# EAGLE design pm25 (EAGLE 9.5.1)
AUTHOR: Jared Wolff; BOARD_NUMBER: BRD-0010; COMPANY: Circuit Dojo; DOC_NUMBER: SCH-0010; DOC_REV: 5; TITLE: Air Quality Wing
Assembly variants: Production
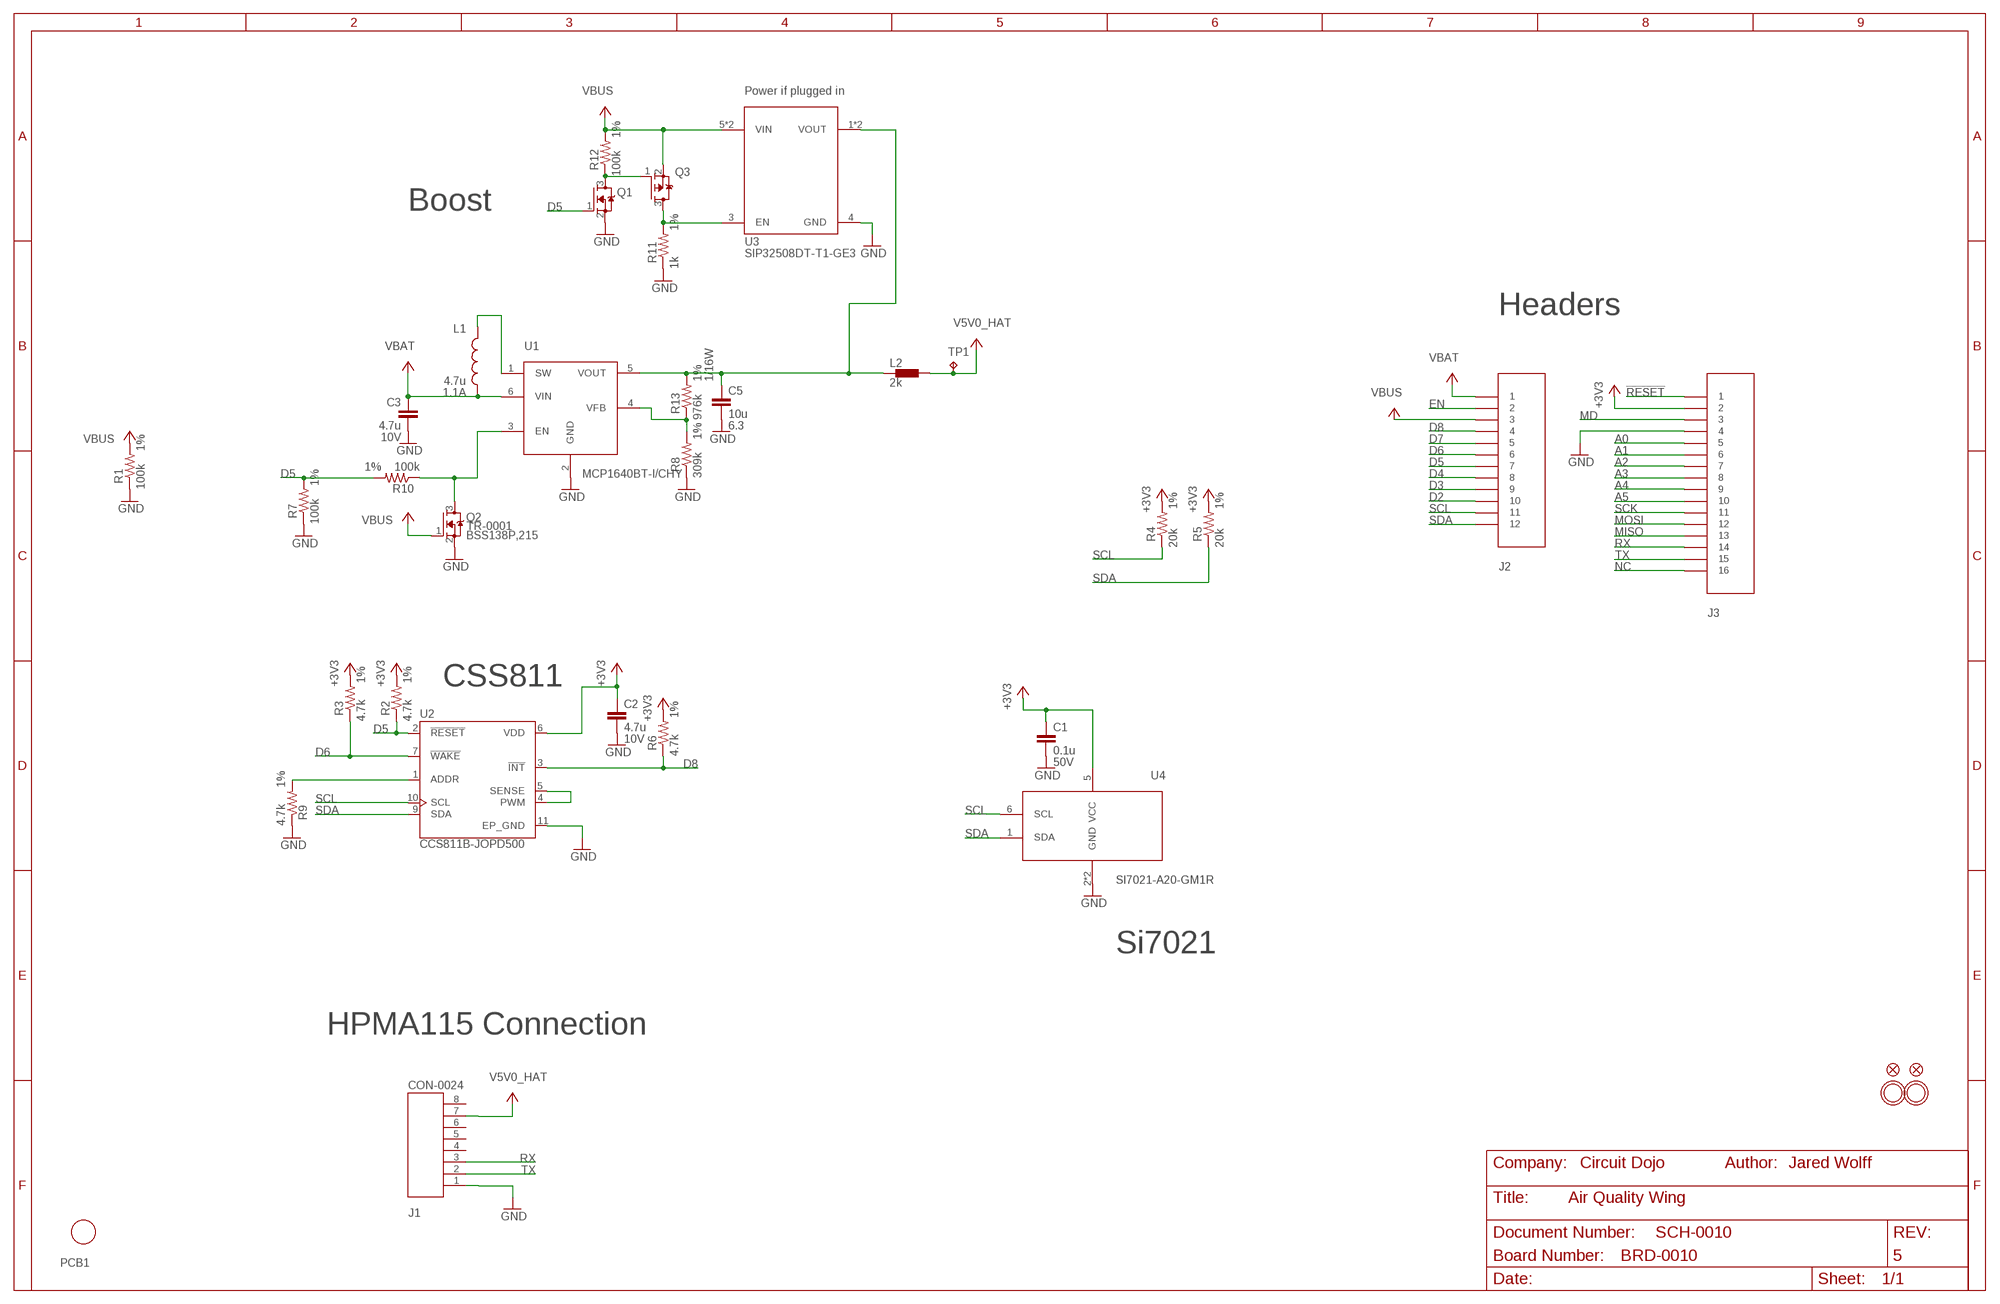
[diagram p0: schematic, sheet 1]

## Parts
C1  0.1u  CAP-0017  [CAPC1005X55N]
C2  4.7u  CAP-0010  [C0603]
C3  4.7u  CAP-0010  [C0603]
C5  10u  CAP-10U-6.3V-0603  [C0603]
J1  CON-0024  [0532610871]
J2  HEADER-12  [CON-HEADER-1X12]
J3  HEADER-16  [CON-HEADER-1X16]
L1  4.7u  IND-0003  [IND-2P0X2P0X1P2]
L2  2k  FERRITE-0805  [R0805]
PCB1  PCB-PS-CCS811-SI7021  [PLACEHOLDER]
Q1  TR-0001  [SOT23]
Q2  TR-0001  [SOT23]
Q3  TR-0003  [SOT23]
R1  100k  RES-0041  [R0402]  (not fitted in variant Production)
R2  4.7k  RES-4.7K-1%-0402  [R0402]
R3  4.7k  RES-4.7K-1%-0402  [R0402]
R4  20k  RES-0054  [R0402]
R5  20k  RES-0054  [R0402]
R6  4.7k  RES-4.7K-1%-0402  [R0402]
R7  100k  RES-0041  [R0402]
R8  309k  RES-309K-1%-0402  [R0402]
R9  4.7k  RES-4.7K-1%-0402  [R0402]
R10  100k  RES-0041  [R0402]
R11  1k  RES-1K-1%-0402  [R0402]
R12  100k  RES-0041  [R0402]
R13  976k  RES-976K-1%-0402  [R0402]
TP1  TP  [TP-1P27]
U1  POWER-VREG-FB-EN-SW-350MA  [SOT23-6]
U2  CCS811B-JOPD500  [SON60P400X270X110-11N]
U3  POWER-SWITCH-SIP32508-SO23-6  [SOT23-6]
U4  SI7021-A20-GM1R  [SON100P300X300X80-7N]
U$31  MOUNTINGHOLE2.5  [MOUNTINGHOLE_2.5_PLATED]
U$32  MOUNTINGHOLE2.5  [MOUNTINGHOLE_2.5_PLATED]
U$34  FIDUCIAL""  [FIDUCIAL_1MM]
U$35  FIDUCIAL""  [FIDUCIAL_1MM]

## Nets
!RESET: J3.1
+3V3: C1.1 C2.1 J3.2 R2.2 R3.2 R4.2 R5.2 R6.2 U2.6(VDD) U4.5(VCC)
A0: J3.5
A1: J3.6
A2: J3.7
A3: J3.8
A4: J3.9
A5: J3.10
D2: J2.10
D3: J2.9
D4: J2.8
D5: J2.7 Q1.1(G) R2.1 R7.2 R10.2 U2.2(!RESET)
D6: J2.6 R3.1 U2.7(!WAKE)
D7: J2.5
D8: J2.4 R6.1 U2.3(!INT)
EN: J2.2
GND: C1.2 C2.2 C3.2 C5.2 J1.1 J3.4 Q1.2(S) Q2.2(S) R1.1 R7.1 R8.1 R9.1 R11.1 U1.2(GND) U2.11(EP_GND) U3.4(GND) U4.2(GND) U4.7(GND)
MD: J3.3
MISO: J3.13
MOSI: J3.12
N$1: L1.P$1 U1.1(SW)
N$2: R8.2 R13.1 U1.4(VFB)
N$3: Q1.3(D) Q3.1(G) R12.1
N$4: R9.2 U2.1(ADDR)
N$5: U2.4(PWM) U2.5(SENSE)
N$6: Q2.3(D) R10.1 U1.3(EN)
N$7: Q3.3(D) R11.2 U3.3(EN)
NC: J3.16
RX: J1.3 J3.14
SCK: J3.11
SCL: J2.11 R4.1 U2.10(SCL) U4.6(SCL)
SDA: J2.12 R5.1 U2.9(SDA) U4.1(SDA)
TX: J1.2 J3.15
V5V0_BEAD: C5.1 L2.1 R13.2 U1.5(VOUT) U3.1(VOUT) U3.2(VOUT)
V5V0_HAT: J1.7 L2.2 TP1.P$1(TP) TP1.P$2(TP) TP1.TP
VBAT: C3.1 J2.1 L1.P$2 U1.6(VIN)
VBUS: J2.3 Q2.1(G) Q3.2(S) R1.2 R12.2 U3.5(VIN) U3.6(VIN)
Unconnected: J1.4 J1.5 J1.6 J1.8

## Notes on the sheet
- Power if plugged in
- Boost
- Headers
- CSS811
- Si7021
- HPMA115 Connection

## Library data of the parts
C1 = wolff-den:CAP-0017: CAP CER 0.1UF 35V X5R 0402; DESC: CAP CER 0.1UF 50V X5R 0402; DIGIKEYPN: 587-3499-1-ND; MF: Taiyo Yuden; MPN: UMK105BJ104KV-F; VOLTHIGH: 50V
C2 C3 = wolff-den:CAP-0010: CAP CER 4.7UF 10V X5R 0603; DIGIKEYPN: 1276-6684-1-ND; MPN: CL10A475MP5LNNC; TEMPHIGH: 85; TEMPLOW: -55; VOLTHIGH: 10V
C5 = wolff-den:CAP: CAPACITOR; DESC: CAP CER 10UF 6.3V X5R 0603; DIGIKEYPN: 587-5869-1-ND; MPN: JMK107ABJ106MA-T; VOLTHIGH: 6.3
J1 = wolff-den:CON-0024; DESC: CONN HEADER SMD R/A 8POS 1.25MM; DIGIKEYPN: WM7626CT-ND; MPN: 0532610871
J2 = wolff-den:HEADER-12; DESC: CONN HDR 12POS 0.1 GOLD PCB; DIGIKEYPN: S7045-ND; MF: Sullins Connector Solutions; MPN: PPPC121LFBN-RC
J3 = wolff-den:HEADER-16; DESC: CONN HDR 16POS 0.1 GOLD PCB; DIGIKEYPN: S7049-ND; MF: Sullins Connector Solutions; MPN: PPPC161LFBN-RC
L1 = wolff-den:IND-0003: FIXED IND 4.7UH 750MA 390 MOHM; CURRENT: 1.1A; DIGIKEYPN: 587-4705-1-ND; MPN: NRV2012T4R7MGF
L2 = wolff-den:FERRITE: FERRITE BEAD; DESC: FERRITE BEAD 2 KOHM 0805 1LN; DIGIKEYPN: 1276-6330-1-ND; MPN: CIM21J202NE
PCB1 = wolff-den:PCB; MPN: BRD-0010
Q1 Q2 = wolff-den:TR-0001: MOSFET N-CH 60V 360MA TO-236AB; DIGIKEYPN: 1727-1142-1-ND; MPN: BSS138P,215; TEMPHIGH: 150; TEMPLOW: -55
Q3 = wolff-den:TR-0003: MOSFET P-CH 50V 130MA SOT23-3; DIGIKEYPN: BSS84-FDICT-ND; MPN: BSS84-7-F; TEMPHIGH: 150; TEMPLOW: -55
R1 R7 R10 R12 = wolff-den:RES-0041: RES SMD 100K OHM 1% 1/16W 0402; DIGIKEYPN: 311-100KLRCT-ND; MPN: RC0402FR07100KL; POWER: 1/16W; TOLERANCE: 1%; VENDOR: Yageo
R2 R3 R6 R9 = wolff-den:RES: RESISTOR; DESC: RES SMD 4.7K OHM 1% 1/16W 0402; DIGIKEYPN: 311-4.7KLRCT-ND; MPN: RC0402FR-074K7L; POWER: 1/16W; TOLERANCE: 1%
R4 R5 = wolff-den:RES-0054: RES SMD 20K OHM 1% 1/16W 0402; DIGIKEYPN: 311-20.0KLRCT-ND; MPN: RC0402FR-0720KL; POWER: 1/16W; TOLERANCE: 1%; VENDOR: Yageo
R8 = wolff-den:RES: RESISTOR; DESC: RES SMD 309K OHM 1% 1/16W 0402; DIGIKEYPN: YAG3108CT-ND; MPN: RC0402FR-07309KL; POWER: 1/16W; TOLERANCE: 1%
R11 = wolff-den:RES: RESISTOR; DESC: RES SMD 1K OHM 1% 1/5W 0402; DIGIKEYPN: 541-2888-1-ND; MPN: RCS04021K00FKED; POWER: 1/5W; TOLERANCE: 1%
R13 = wolff-den:RES: RESISTOR; DESC: RES SMD 976K OHM 1% 1/16W 0402; DIGIKEYPN: YAG3265CT-ND; MPN: RC0402FR-07976KL; POWER: 1/16W; TOLERANCE: 1%
TP1 = wolff-den:TP: TEST POINT
U1 = wolff-den:POWER-VREG-FB-EN-SW: IC CONV BOOST SOT-23-6; DIGIKEYPN: MCP1640BT-I/CHYCT-ND; MPN: MCP1640BT-I/CHY; TEMPHIGH: 125; TEMPLOW: -40; VOLTHIGH: 5.5V; VOLTLOW: 0.8V
U2 = wolff-den:CCS811B-JOPD500: Low Power Digital Sensor For Ind; DESC: Low Power Digital Sensor For Ind; DIGIKEYPN: CCS811B-JOPD500CT-ND; MF: ams; MPN: CCS811B-JOPD500
U3 = wolff-den:POWER-SWITCH: IC SWITCH; DESC: IC LOAD SWITCH SOT23-6; DIGIKEYPN: SIP32508DT-T1-GE3CT-ND; MPN: SIP32508DT-T1-GE3
U4 = wolff-den:SI7021-A20-GM1R; DESC: SENS HUMID/TEMP 3.6V I2C 2% 6DFN; DIGIKEYPN: 336-4380-1-ND; MPN: SI7021-A20-GM1R
U$31 U$32 = microbuilder:MOUNTINGHOLE: Mounting Hole For #2 screws (0.086"/2.18mm width, 0.094"/2.4mm hole) use 2.5mm; BOM: EXCLUDE
U$34 U$35 = microbuilder:FIDUCIAL: Fiducial Alignment Points Various fiducial points for machine vision alignment.; BOM: EXCLUDE

## Board
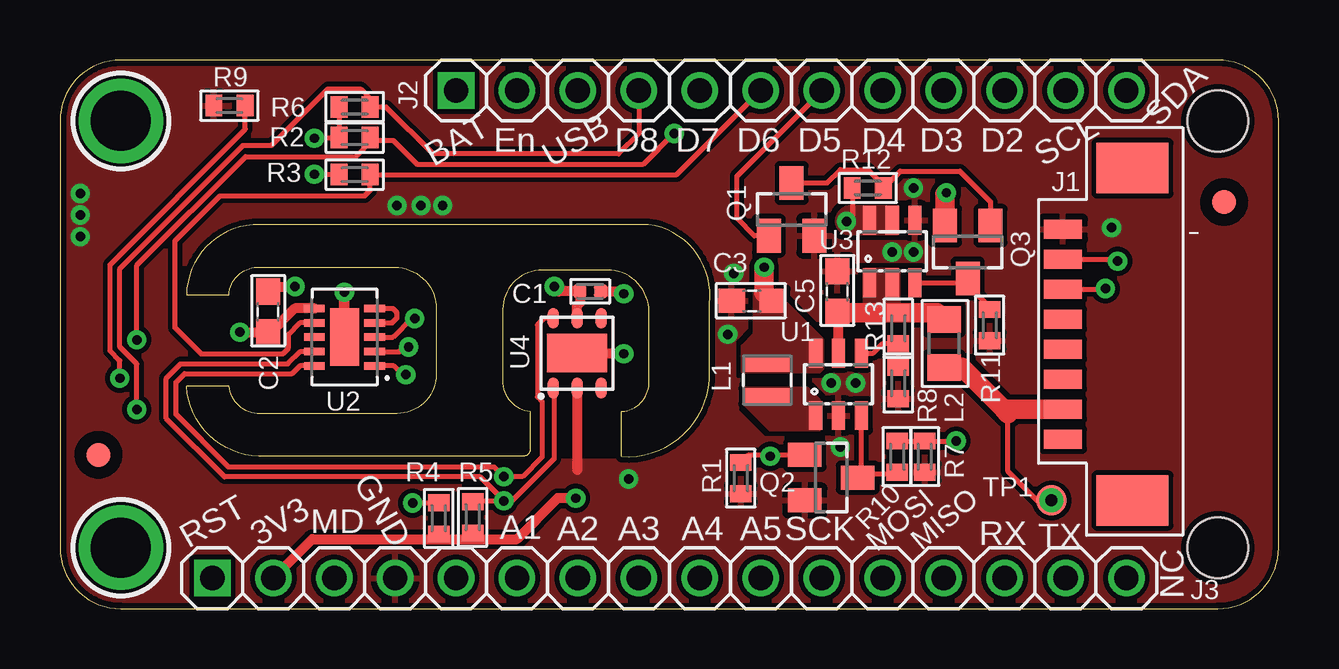
[diagram p1: board, top side]
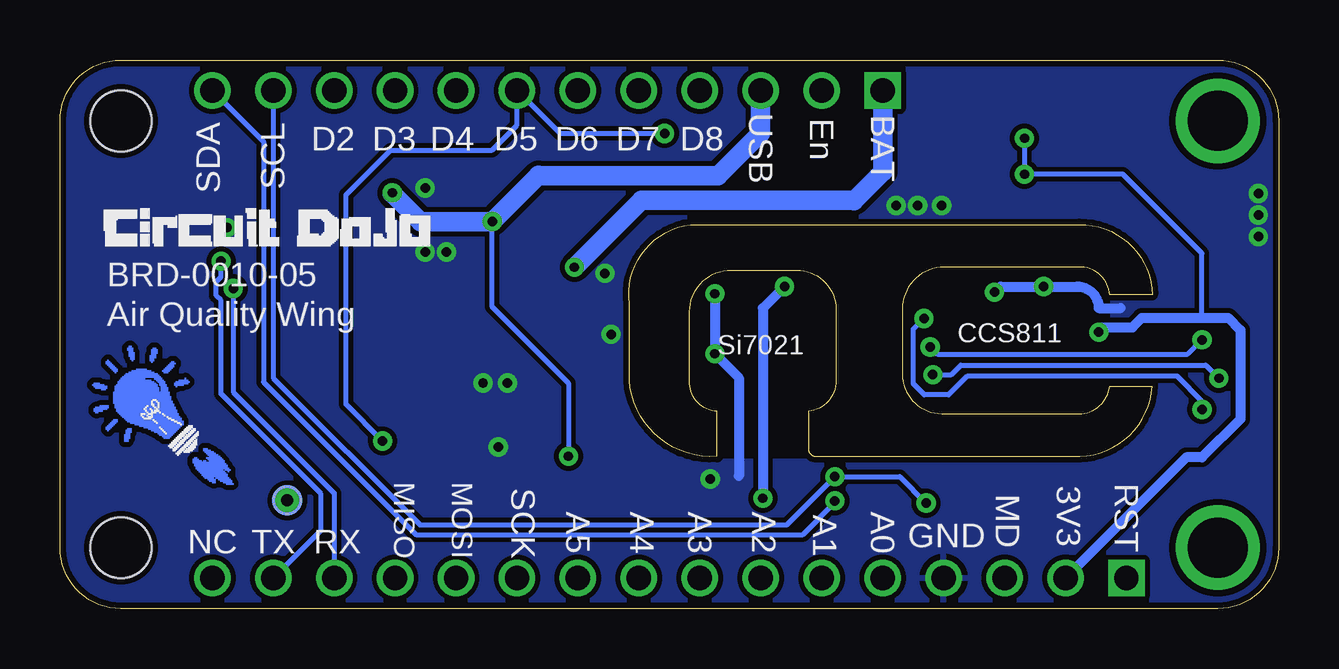
[diagram p2: board, bottom side, seen from below]

Size 50.8 x 22.86 mm. Coordinates in mm from the lower left corner, seen from the top.
Outline: 23.41,6.34 arc90 27.07,9.53 27.07,12.7 arc90 24.53,16 8.32,16 arc90 5.27,13.08 7.05,13.08 arc-90 8.32,14.22 13.95,14.22 arc-90 15.69,12.49 15.69,9.77 arc-90 14.05,8.13 8.45,8.13 arc-90 7.05,9.27 5.27,9.27 arc90 8.57,6.35 19.31,6.35 arc90 19.6,6.64 19.6,8.22 arc-90 18.46,9.62 18.46,12.47 arc-90 20.1,14.11 22.82,14.11 arc-90 24.55,12.37 24.55,9.49 arc-90 23.41,8.22 23.41,6.34
Outline: 23.41,6.34 23.41,6.34
Outline: 2.54,0 48.26,0 arc90 50.8,2.54 50.8,20.32 arc90 48.26,22.86 2.54,22.86 arc90 0,20.32 0,2.54 arc90 2.54,0
Copper layers (1*16): Top 0.035mm / dielectric 1.5mm / Bottom 0.035mm
Design rules "adafruit *": minimum track width 8mil, minimum drill 15.5mil, track to track 8mil, track to pad 8mil, pad to pad 8mil, via to via 8mil, smd to smd 8mil, copper to edge 10mil, drill to drill 8mil, minimum pad ring 10mil, minimum via ring 8mil, stop-mask expansion 2mil, vias tented up to drill 20mil, thermal gap 10mil
Holes 2.54 mm at 48.26,20.32 48.26,2.54
tRestrict: area 5.4,8.2 to 15.8,14.3; area 18.6,6.3 to 24.7,14.1
bRestrict: area 18.5,6.3 to 24.6,14.1; area 7.1,8.2 to 15.7,14.3

### Footprints (pad centres in the part's own frame; a part is rotated, then mirrored left to right if it is on the bottom)
CAPC1005X55N = smd 0.54 x 0.6: 1 -0.43,0; 2 0.43,0
C0603 = smd 1.1 x 1: 1 -0.85,0; 2 0.85,0
0532610871 = smd 0.8 x 1.6: 1 4.375,0; 2 3.125,0; 3 1.875,0; 4 0.625,0; 5 -0.625,0; 6 -1.875,0; 7 -3.125,0; 8 -4.375,0 | smd 2.1 x 3: P$9 -6.925,-2.9; P$10 6.925,-2.9
CON-HEADER-1X12 = drill 1.016 square: 1 0,0 | drill 1.016: 2 2.54,0; 3 5.08,0; 4 7.62,0; 5 10.16,0; 6 12.7,0; 7 15.24,0; 8 17.78,0; 9 20.32,0; 10 22.86,0; 11 25.4,0; 12 27.94,0
CON-HEADER-1X16 = drill 1.016 square: 1 0,0 | drill 1.016: 2 2.54,0; 3 5.08,0; 4 7.62,0; 5 10.16,0; 6 12.7,0; 7 15.24,0; 8 17.78,0; 9 20.32,0; 10 22.86,0; 11 25.4,0; 12 27.94,0; 13 30.48,0; 14 33.02,0; 15 35.56,0; 16 38.1,0
IND-2P0X2P0X1P2 = smd 0.65 x 2: P$1 -0.675,0; P$2 0.675,0
R0805 = smd 1.1 x 1.4: 1 -1,0; 2 1,0
SOT23 = smd 1 x 1.4: 1 -0.95,-1.1; 2 0.95,-1.1; 3 0,1.1
R0402 = smd 0.7 x 0.9: 1 -0.65,0; 2 0.65,0
TP-1P27 = drill 0.5: P$1 0,0 | smd 1.27 x 1.27 bottom: P$2 0,0 | smd 1.27 x 1.27: TP 0,0
SOT23-6 = smd 0.55 x 1.2: 1 -0.95,-1.3; 2 0,-1.3; 3 0.95,-1.3; 4 0.95,1.3; 5 0,1.3; 6 -0.95,1.3
SON60P400X270X110-11N = smd 0.91 x 0.32: 1 -1.255,1.2; 2 -1.255,0.6; 3 -1.255,0; 4 -1.255,-0.6; 5 -1.255,-1.2; 6 1.255,-1.2; 7 1.255,-0.6; 8 1.255,0; 9 1.255,0.6; 10 1.255,1.2 | smd 1.2 x 2.4: 11 0,0
SON100P300X300X80-7N = smd 0.85 x 0.45: 1 -1.45,1; 2 -1.45,0; 3 -1.45,-1; 4 1.45,-1; 5 1.45,0; 6 1.45,1 | smd 1.6 x 2.5: 7 0,0
MOUNTINGHOLE_2.5_PLATED = drill 2.5 pad 3.2: P$1 0,0
FIDUCIAL_1MM = smd 1 x 1: 1 0,0

### Placement (x,y rotation side)
C1  22.1,13.22 0 top
C2  8.68,12.36 90 top
C3  28.85,12.83 180 top
C5  32.4,13.21 90 top
J1  41.8,11.43 90 top
J2  16.51,21.59 0 top
J3  6.35,1.27 0 top
L1  29.48,9.53 90 top
L2  36.85,11.05 270 top
PCB1  -12.93,-5.08 0 top  (outside the outline)
Q1  30.5,16.64 0 top
Q2  32.15,5.46 270 top
Q3  37.84,14.86 180 top
R1  28.38,5.44 90 top
R2  12.28,19.63 180 top
R3  12.28,18.08 180 top
R4  15.79,3.76 270 top
R5  17.2,3.8 270 top
R6  12.28,20.9 180 top
R7  36.04,6.33 90 top
R8  34.94,9.4 90 top
R9  7.06,20.96 0 top
R10  34.9,6.33 90 top
R11  38.75,11.81 90 top
R12  33.67,17.53 180 top
R13  34.94,11.68 90 top
TP1  41.33,4.51 180 top
U1  32.45,9.35 0 top
U2  11.86,11.31 180 top
U3  34.69,14.88 0 top
U4  21.56,10.64 90 top
U$1  [LOGO-CIRCUITDOJO-BULB]  43.4,4.82 90 bottom
U$2  [LOGO-CIRCUITDOJO]  49.21,14.72 0 bottom
U$31  2.54,20.32 270 top
U$32  2.54,2.54 270 top
U$34  1.6,6.41 270 top
U$35  48.52,16.94 270 top

### Tracks (layer width: path | path; a pad name or v marks a point on that pad's centre or on a via)
+3V3  (via drill 0.39)
  Top 0.203: v10.6,18.1 10.62,18.08 R3.2 | v10.6,19.6 10.63,19.63 11.6,19.63 | 11.6,19.63 R2.2 | R6.2 11.63,19.66 11.6,19.63 | R4.2 15.8,2.9 | R5.2 17.2,2.9
  Top 0.305: v7.5,11.52 7.53,11.55
  Top 0.406: U4.5 21.56,12.62 21.67,12.74 C1.1 20.8,13.22 v20.6,13.42 | v7.5,11.52 v7.51,11.51 C2.1 8.79,11.51 9.79,12.51 U2.6 | J3.2 10.52,2.9 15.8,2.9 17.2,2.9 19.05,2.9 20.75,4.6 v21.5,4.6
  Bottom 0.203: 3.2,12.11 3.2,14.8 6.5,18.1 v10.6,18.1 v10.6,19.6
  Bottom 0.406: v20.6,13.42 21.5,12.52 v21.5,4.6 | v7.5,11.52 7.5,11.72 6.1,11.72 5.71,12.11 3.2,12.11 2.11,12.11 1.6,11.6 1.6,7.9 3.2,6.3 3.86,6.3 J3.2
D5  (via drill 0.39)
  Top 0.203: R10.2 R7.2 v37.35,6.99 | U2.2 14.14,10.7 14.35,10.9 v14.53,10.9 | Q1.1 28.93,15.54 28.21,16.26 28.21,18.01 31.75,21.55 J2.7 | v3.2,11.2 3.13,11.13 | v3.2,11.2 3.35,11.2 | v25.6,19.8 24.3,18.5 14.9,18.5 13.9,19.5 13.04,19.5 13.02,19.52 | v3.2,11.2 3.2,14.3 7.74,18.84 12.34,18.84 13.02,19.52 | R2.1 13.03,19.53 13.02,19.52
  Bottom 0.203: v37.35,6.99 38.88,8.51 38.88,17.24 37.02,19.1 32.8,19.1 31.75,20.15 J2.7 29.96,19.8 v25.6,19.8 | v14.53,10.9 14.23,10.6 3.8,10.6 v3.2,11.2
D6
  Top 0.203: U2.7 9.99,11.91 9.5,11.42 9.5,10.82 9.3,10.62 5.88,10.62 4.8,11.7 4.8,15.32 6.67,17.2 12.7,17.2 12.93,17.43 R3.1 25.7,18.08 J2.6
D8  (via drill 0.39)
  Top 0.203: U2.3 13.88,11.31 14.66,12.09 v14.79,12.09 | 3.14,8.24 v3.2,8.3 3.2,10.2 2.5,10.91 2.5,14.17 7.62,19.3 8.82,19.3 11.17,21.66 12.53,21.66 12.93,21.25 R6.1 13.6,20.9 15.55,18.95 23.29,18.95 24.13,19.79 J2.4
  Bottom 0.203: v14.79,12.09 15.23,11.64 15.23,9.37 14.77,8.91 13.76,8.91 12.97,9.7 4.25,9.7 3.2,8.65 v3.2,8.3
GND  (via drill 0.39)
  Top 0.406: 11.85,11.97 v11.85,13.18 U2.11 | U4.2 21.56,5.78 | U4.7 23.48,10.64 v23.5,10.62 | C1.2 23.4,13.22 v23.5,13.12 | C2.2 8.89,13.42 v9.8,13.42
  Bottom 0.406: v11.85,13.18 11.84,13.18 11.6,13.42 v9.8,13.42 8.4,13.42 arc90 7.5,12.52 6.6,12.52 | v23.5,13.12 v23.5,10.62 22.5,9.62 22.5,5.52
  other vias: 35.58,17.53 35.58,14.86 34.69,14.86 32.15,9.4 32.53,6.73 33.16,9.4 27.83,11.43 28.08,13.97 43.83,15.88 23.7,5.4 14.05,16.8 15.05,16.8 15.95,16.8 0.85,17.3 0.85,16.4 0.85,15.5
  pour Top (rank 2): 0,22.86 0,0 55.88,0 55.88,22.86
  pour Bottom (rank 2): 55.88,-5.08 0,-5.08 0,27.94 55.88,27.94
N$1
  pour Top (no thermals): 28.59,9.14 28.59,8.51 29.61,7.49 31.64,7.49 31.64,8.64 31.13,9.14
N$2
  Top 0.203: R8.2 R13.1 34.93,11.05 34.31,11.05 33.91,10.65 U1.4
N$3
  Top 0.203: 34.63,17.83 34.38,17.58 33.67,18.29 32.53,18.29 31.98,17.74 Q1.3 | 34.63,17.83 35.03,18.23 37.51,18.23 38.79,16.96 Q3.1 | R12.1 34.63,17.83
N$4  (via drill 0.39)
  Top 0.203: U2.1 13.91,10.11 14.27,9.75 v14.42,9.75 | v2.5,9.6 2.5,10.33 2.09,10.74 2.09,14.34 7.72,19.98 7.72,20.94 R9.2
  Bottom 0.203: v14.42,9.75 13.65,9.75 13.25,10.15 3.04,10.15 v2.5,9.6
N$5
  Top 0.203: U2.4 13.85,11.91 14.04,12.09 14.04,12.35 13.87,12.51 U2.5
N$6
  Top 0.203: U1.3 33.4,5.62 33.4,5.61 | 33.4,5.61 Q2.3 | R10.1 34.82,5.61 33.4,5.61
N$7
  Top 0.203: U3.3 37.66,13.58 Q3.3 37.84,13.48 38.75,12.56 R11.2
RX  (via drill 0.39)
  Top 0.203: J1.3 43.55,13.3 v43.58,13.34
  Bottom 0.203: v43.58,13.34 43.58,9.02 39.37,4.81 J3.14
SCL  (via drill 0.39)
  Top 0.203: U4.6 20.17,12.09 19.9,11.82 19.9,8.82 20.1,8.62 20.1,6.32 19.28,5.5 v18.5,5.5 18.1,5.9 7.02,5.9 4.83,8.09 4.83,9.43 5.19,9.79 9.69,9.79 10.01,10.11 U2.10 | R4.1 15.78,4.4 v14.7,4.4
  Bottom 0.203: J2.11 41.91,9.61 35.8,3.5 20.5,3.5 v18.5,5.5 15.8,5.5 v14.7,4.4
SDA  (via drill 0.39)
  Top 0.203: U4.1 20.6,9.15 20.6,6.25 18.85,4.49 v18.5,4.49 | v18.5,4.49 17.5,5.49 6.86,5.49 4.43,7.92 4.43,9.6 5.02,10.2 9.5,10.2 10,10.7 10.6,10.7 U2.9 | R5.1 17.24,4.49 v18.5,4.49
  Bottom 0.203: J2.12 42.32,19.46 42.32,9.44 35.96,3.09 19.84,3.09 18.5,4.43 v18.5,4.49 18.23,4.49
TX  (via drill 0.39)
  Top 0.203: J1.2 44.01,14.55 v44.09,14.48
  Bottom 0.203: v44.09,14.48 44.09,13.82 44.28,13.63 44.28,13.04 44.09,12.85 44.09,8.95 39.94,4.8 39.94,3.24 J3.15
V5V0_BEAD
  Top 0.406: U1.5 32.45,12.31 C5.1
  Top 0.813: 32.45,12.31 32.48,12.33 R13.2 36.56,12.33 L2.1
  pour Top (no thermals): 33.55,14.1 33.55,12.45 34.94,12.45 34.94,14.1
V5V0_HAT
  Top 0.203: TP1.P$1 41.02,4.21 39.51,5.71 39.51,8.13
  Top 0.813: 39.51,8.13 39.34,8.3 | J1.7 39.34,8.3 | L2.2 37.59,10.05 39.34,8.3
VBAT  (via drill 0.39)
  Top 0.813: v29.35,14.22 29.35,13.17 C3.1
  Bottom 0.813: v29.35,14.22 26.56,17.02 17.72,17.02 17.7,17 16.5,18.2 J2.1
  pour Top (no thermals): 28.46,10.92 28.46,9.91 31.64,9.91 31.77,10.03 31.77,11.18 29.99,12.95 29.99,13.21 28.97,13.21 28.97,11.43
VBUS  (via drill 0.39)
  Top 0.203: v29.61,6.35 29.67,6.41 | 29.67,6.41 Q2.1 | R12.2 33.02,16.37 v32.78,16.13 | 28.43,6.14 R1.2 28.7,6.41 29.67,6.41
  Top 0.813: v36.95,17.33 36.89,17.27 Q3.2
  Bottom 0.203: v29.61,6.35 29.61,9.4 32.78,12.57 v32.78,16.13
  Bottom 0.813: 30.85,18.06 30.88,18.03 | v36.95,17.33 36.95,17.3 35.77,16.13 v32.78,16.13 30.88,18.03 | J2.3 21.6,19.8 23.37,18.03 30.88,18.03
  pour Top (no thermals): 34.92,16.71 32.99,16.71 arc90 32.4,16.13 arc90 32.86,15.67 34.92,15.67

### Text on the board
tPlace: SDA | BAT | En | USB | D8 | D7 | D6 | D5 | D4 | D3 | D2 | SCL | RST | 3V3 | MD | GND | MOSI | MISO | A1 | A2 | A3 | A4 | A5 | SCK | RX | TX | NC
bPlace: En | D8 | D7 | D6 | D5 | D4 | D3 | D2 | BAT | USB | SCL | SDA | BRD-0010-05 | Air Quality Wing | CCS811 | Si7021 | RST | 3V3 | MD | SCK | MOSI | MISO | GND | A0 | A1 | A2 | A3 | A4 | A5 | RX | TX | NC